# Altium project OAmp_TestBoard.PrjPCB
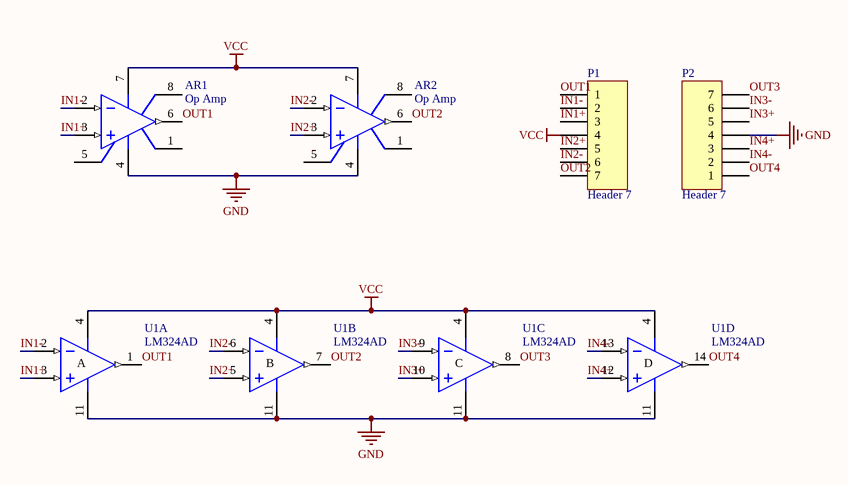
[diagram p0: OAmp_TestBoard.SchDoc]
1 sheet, 5 parts. Net scope: global (net labels, ports and power ports of the same name join across sheets).
Board file: OAmp_TestBoard.PcbDoc

## Sheet OAmp_TestBoard.SchDoc
size A4

### Parts
AR1  Op Amp  [SOT-23-OT5_N]
AR2  Op Amp  [SOT-23-OT5_N]
P1  Header 7  [HDR1X7]
P2  Header 7  [HDR1X7]
U1  LM324AD  [SO14_N]  (parts A,B,C,D of 4)

### Nets
GND: AR1.4(V-) AR2.4(V-) P2.4 U1.11(V-)
VCC: AR1.7(V+) AR2.7(V+) P1.4 U1.4(V+)
IN1+: AR1.3(IN+) P1.3 U1.3(IN+)
IN1-: AR1.2(IN-) P1.2 U1.2(IN-)
IN2+: AR2.3(IN+) P1.5 U1.5(IN+)
IN2-: AR2.2(IN-) P1.6 U1.6(IN-)
IN3+: P2.5 U1.10(IN+)
IN3-: P2.6 U1.9(IN-)
IN4+: P2.3 U1.12(IN+)
IN4-: P2.2 U1.13(IN-)
OUT1: AR1.6(OUT) P1.1 U1.1(OUT)
OUT2: AR2.6(OUT) P1.7 U1.7(OUT)
OUT3: P2.7 U1.8(OUT)
OUT4: P2.1 U1.14(OUT)

Not connected (* = marked no-connect by the designer): AR1 1(OS_NUL) 5(OS_NUL) 8(TAB); AR2 1(OS_NUL) 5(OS_NUL) 8(TAB)

### Notes on the sheet
- (in symbol LM324AD, part A) A
- (in symbol LM324AD, part B) B
- (in symbol LM324AD, part C) C
- (in symbol LM324AD, part D) D

### Library data of the parts
AR1 AR2 = Op Amp: FET Operational Amplifier; pin to pad: 1>6 2>4 4>2 5>7 6>1 7>5; Published: 8-Jun-2000; LatestRevisionDate: 17-Jul-2002; LatestRevisionNote: Re-released for DXP Platform.; DatasheetVersion: REV. B; PackageReference: H-08A; Publisher: Altium Limited; ComponentLink1Description: Manufacturer Link; ComponentLink1URL: http://www.analog.com/
P1 P2 = Header 7: Header, 7-Pin; LatestRevisionDate: 17-Jul-2002; LatestRevisionNote: Re-released for DXP Platform.; Publisher: Altium Limited
U1 = LM324AD: Low-Power Quad Operational Amplifier; Published: 24-Aug-2001; LatestRevisionDate: 13-Apr-2006; LatestRevisionNote: IPC-7351 Footprint Added.; DatasheetVersion: Nov-1997; PackageVersion: Sep-1998; PackageReference: SO14; Publisher: Altium Limited; PackageDescription: 14-Pin Small Outline Integrated Circuit 1.27 mm Pitch; Code_IPC: SOIC127P600-14; ComponentLink1Description: Manufacturer Link; ComponentLink1URL: http://www.st.com/; ComponentLink2Description: Datasheet; ComponentLink2URL: http://www.st.com/stonline/products/literature/ds/4797/lm224a.pdf